# Altium schematic sheet P1.schdoc
size 508 x 381 mm; Symbol: Drawing-Symbol_A4; Company: 嘉立创EDA; Drawed: Adrian; Version: V1.0; @Project Name: F1C100S; @Update Date: 2025-12-29; @Create Date: 2025-12-29; Device: Drawing-Symbol_A4; @Board Name: Board1; @Page Name: P1; @Create Time: 16:48:25; @Page Count: 1; @Page No: 1; @Schematic Name: Schematic1; @Update Time: 16:48:25; @Assembly Variant: Basic; Border: 1; Title Block Position: 3; Size: A4; Width: 2000; Height: 1500; Region Start: 1; X Region Count: 6; Y Region Count: 4; Blade Width: 10; Title Block: 1
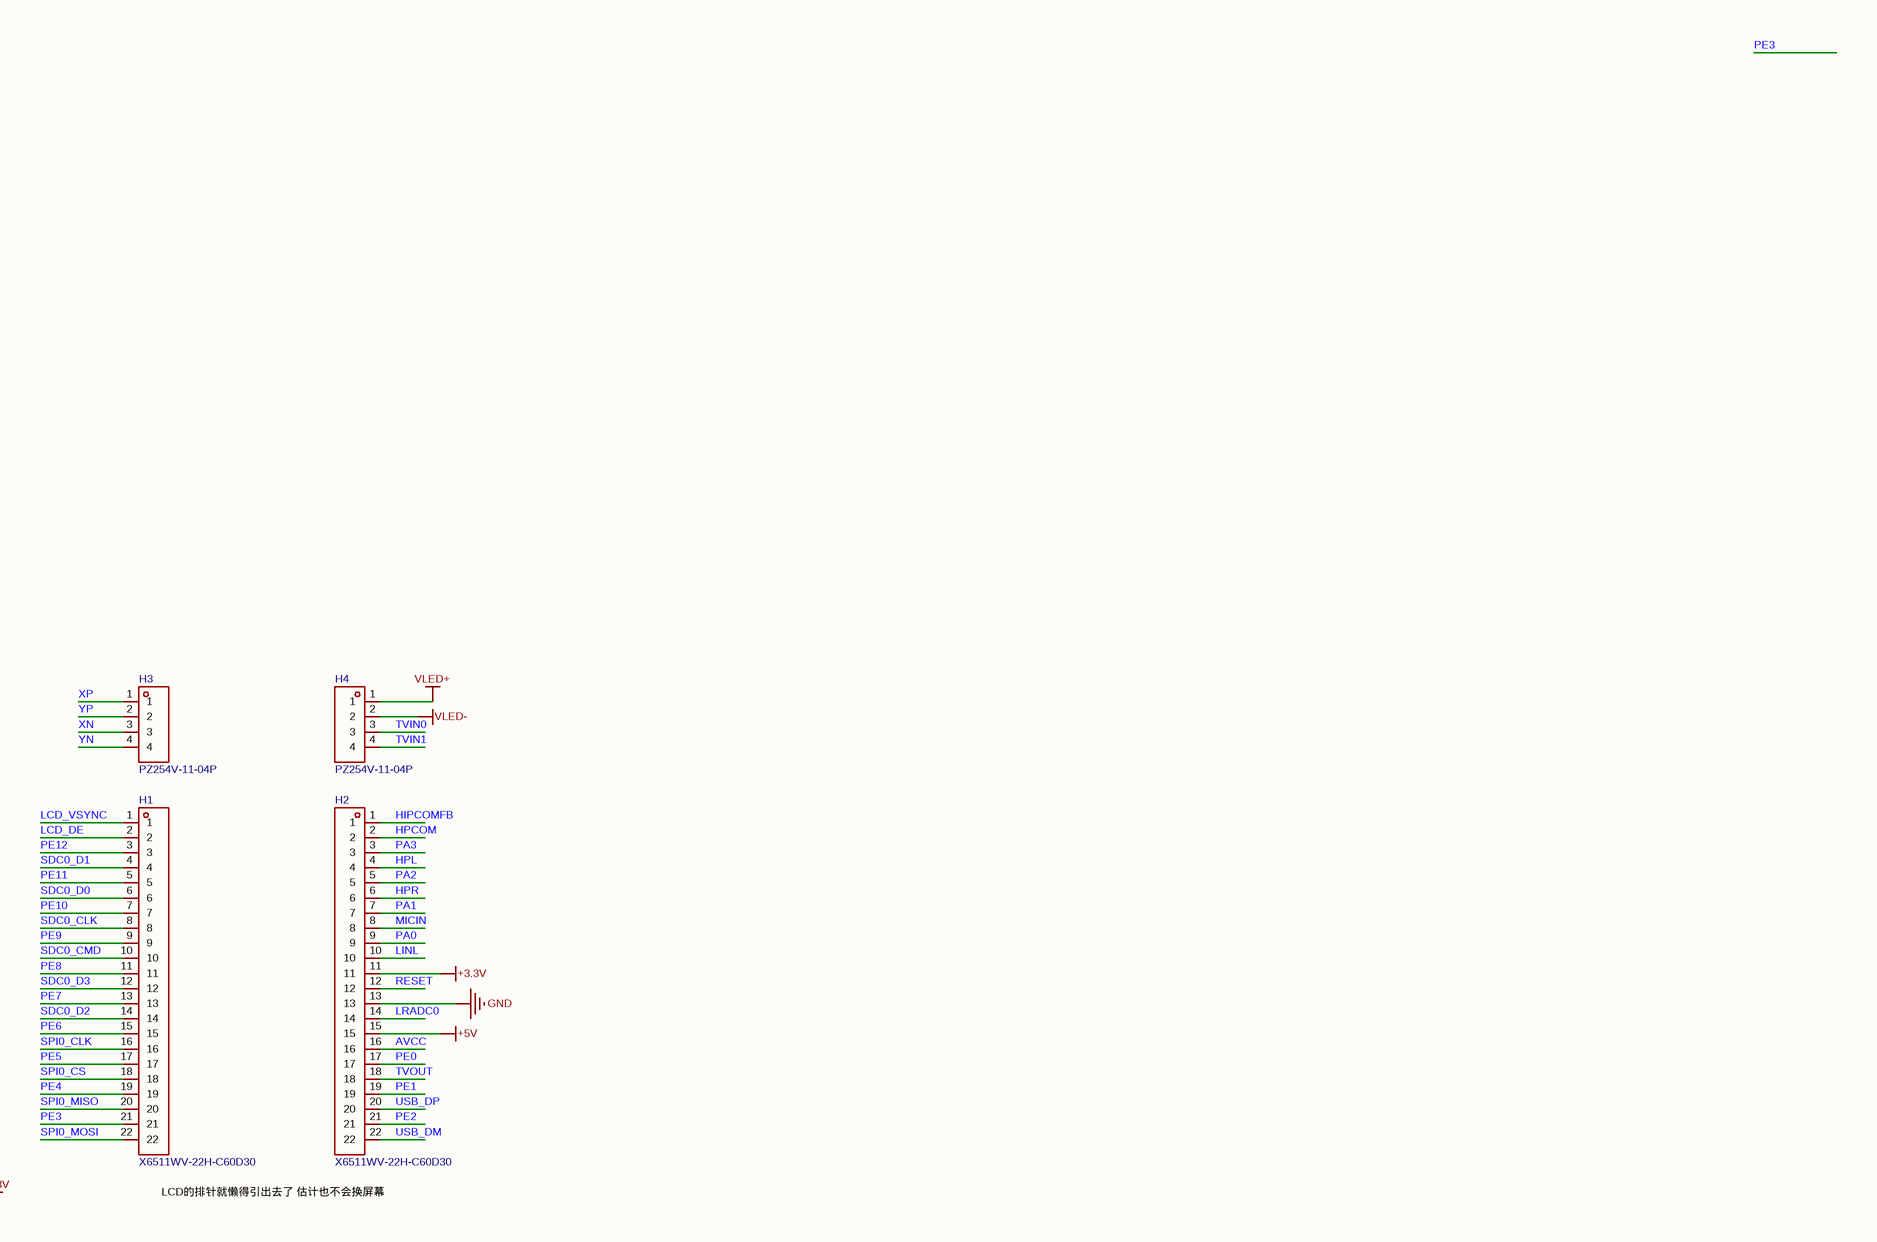
[diagram p0: P1.schdoc, top right]
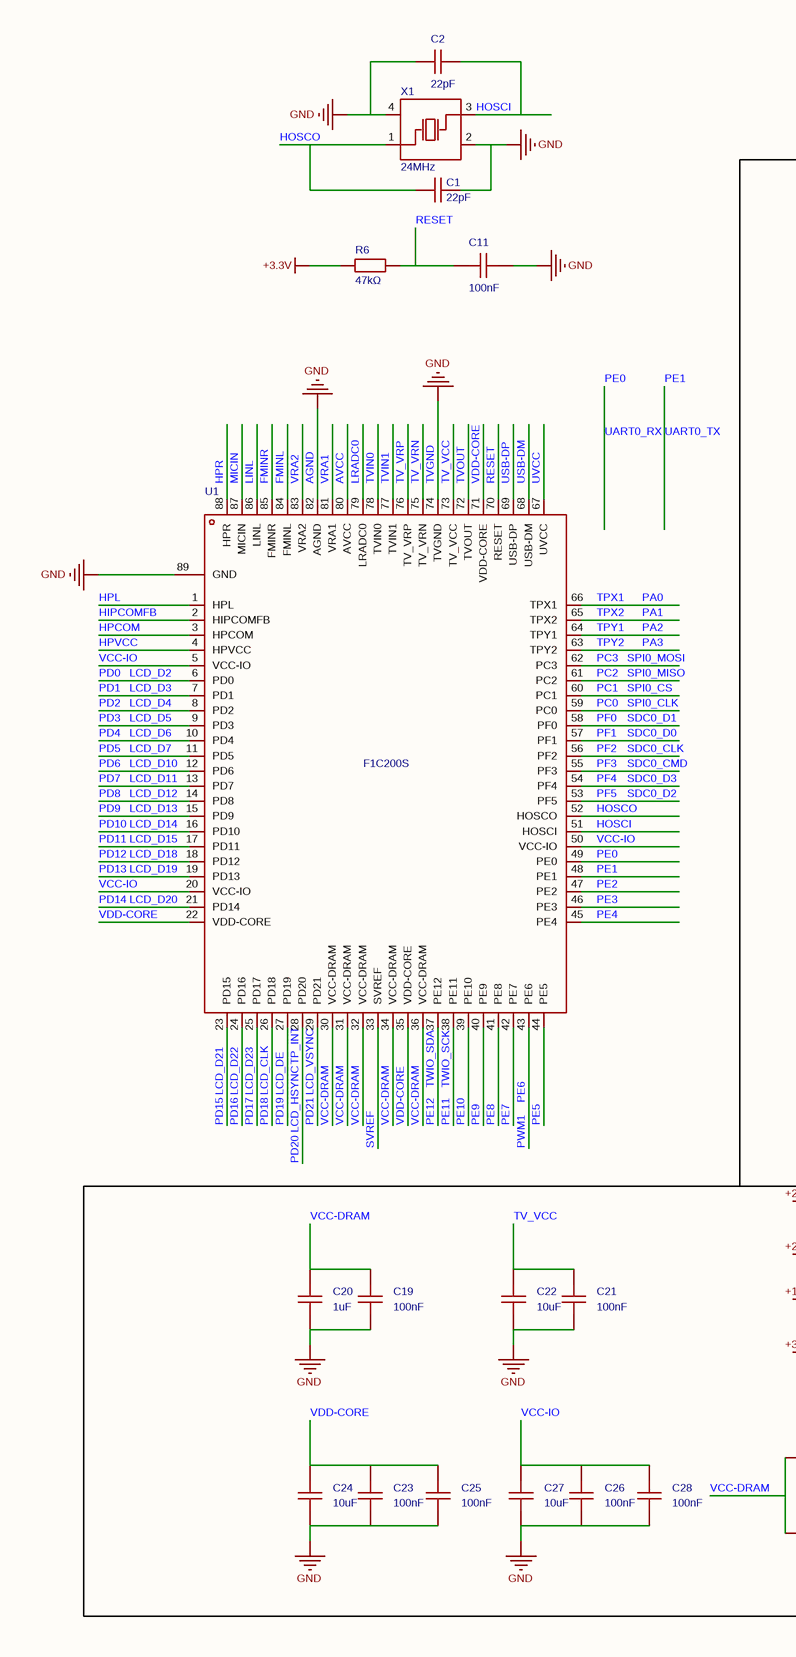
[diagram p1: P1.schdoc, bottom left]
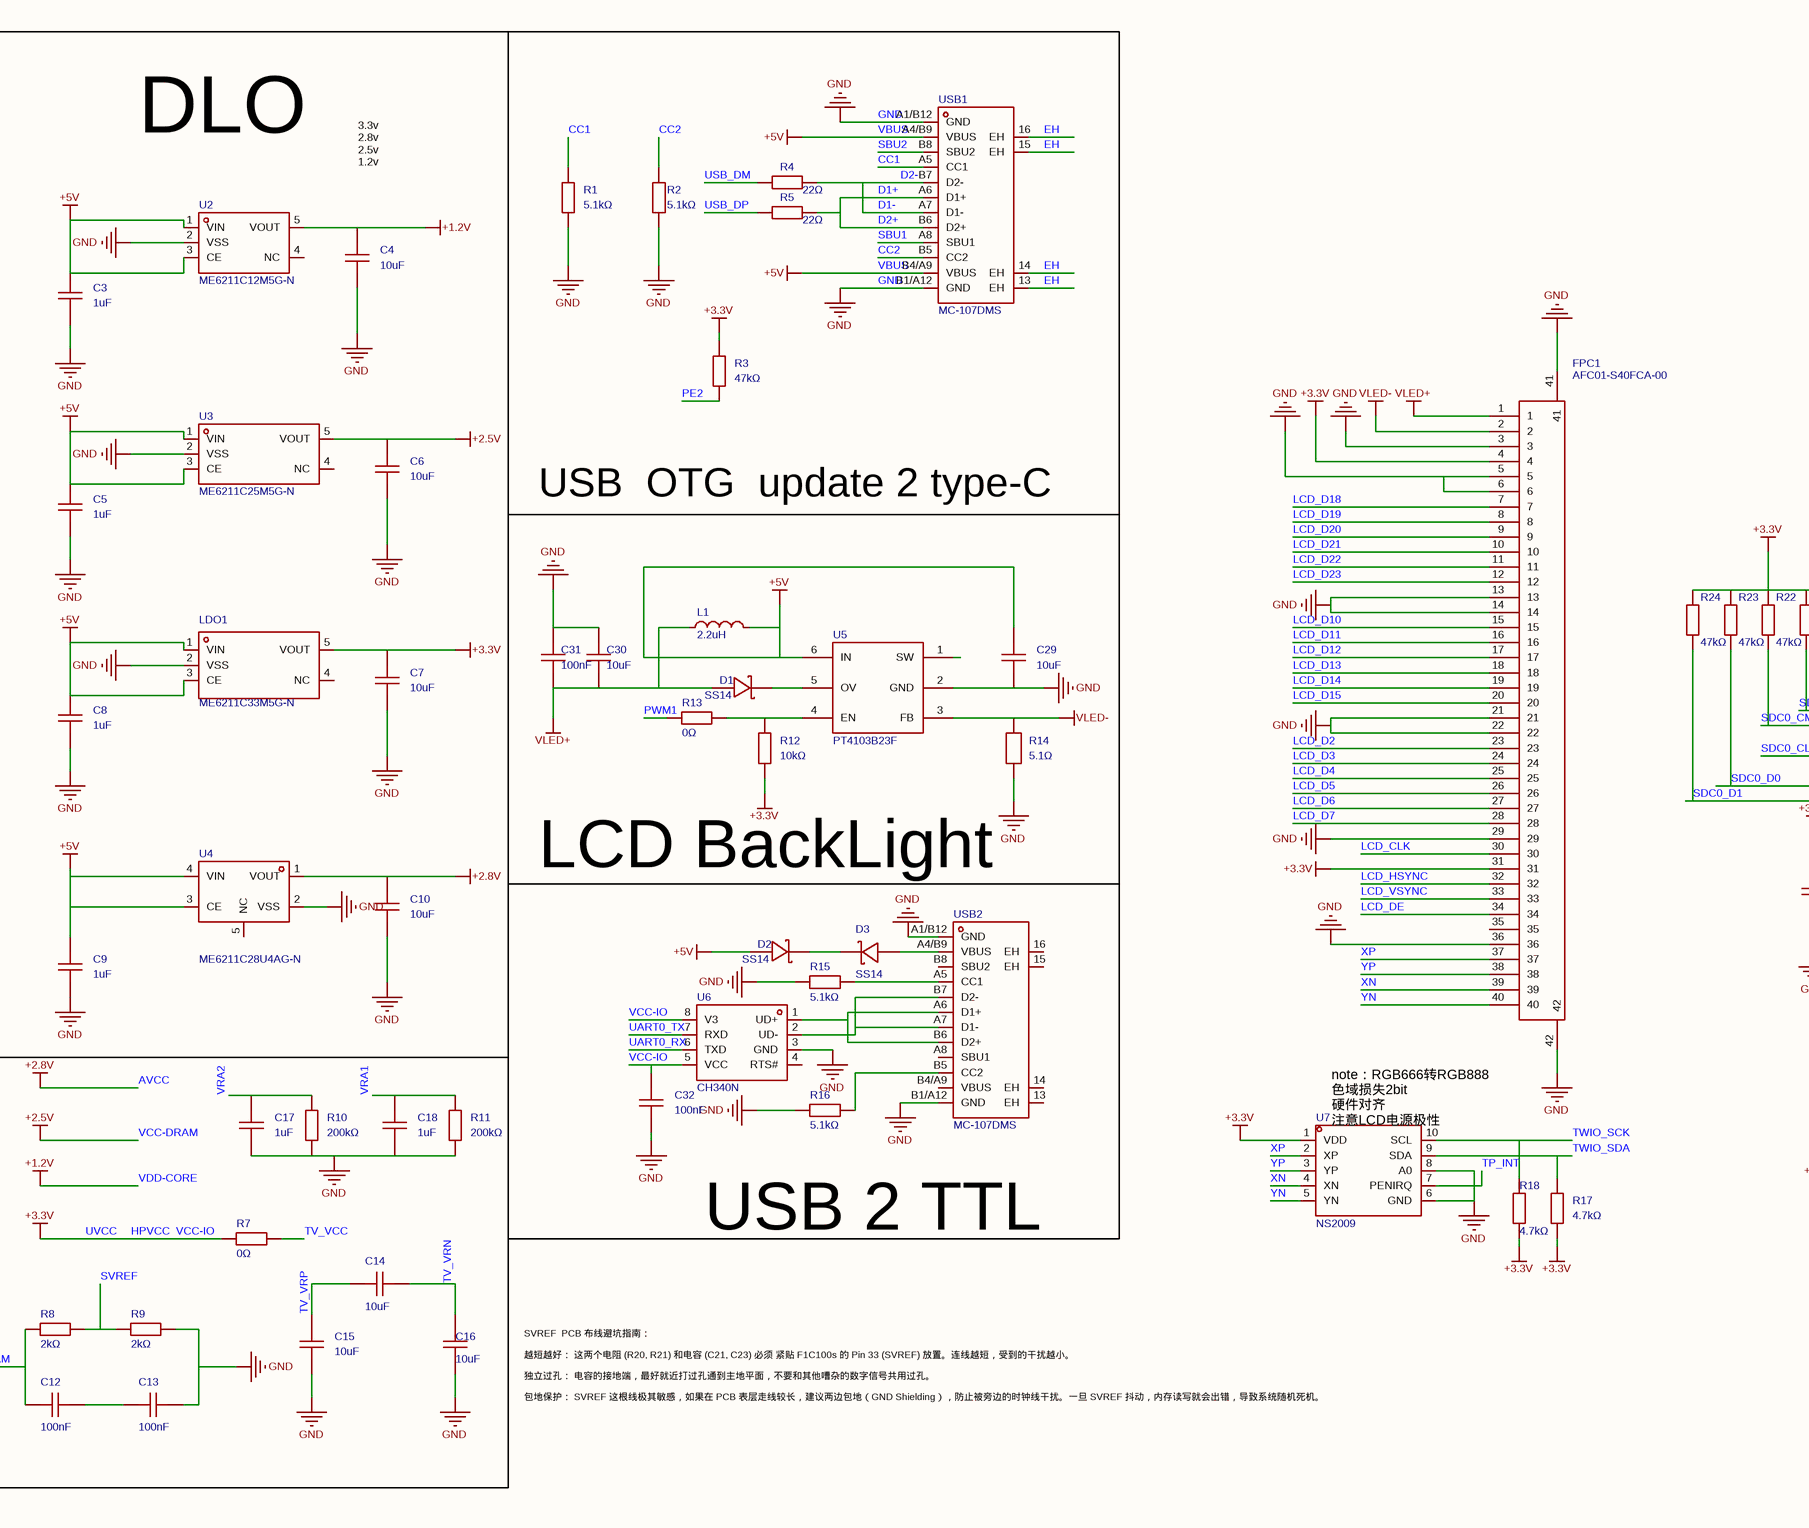
[diagram p2: P1.schdoc, bottom middle]
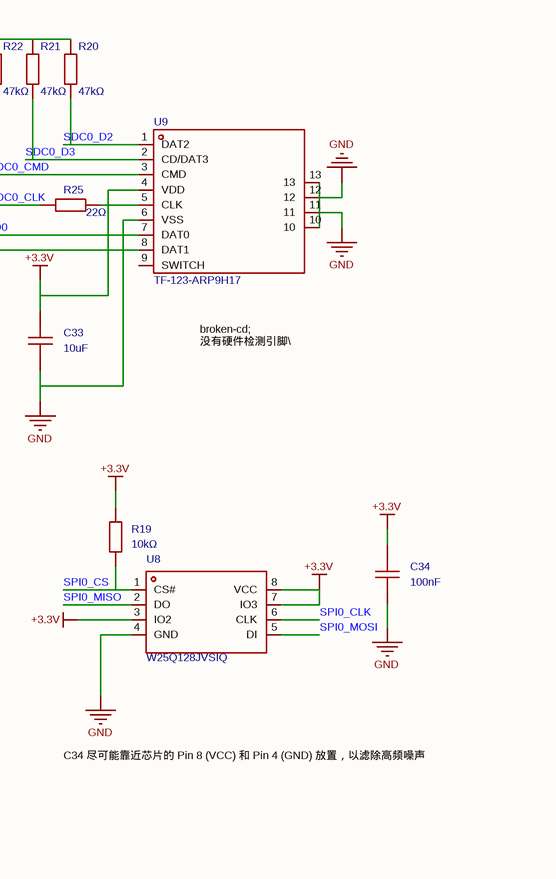
[diagram p3: P1.schdoc, bottom right]

## Parts
C1  22pF  [C0603]
C2  22pF  [C0603]
C3  1uF  [C0603]
C4  10uF  [C0603]
C5  1uF  [C0603]
C6  10uF  [C0603]
C7  10uF  [C0603]
C8  1uF  [C0603]
C9  1uF  [C0603]
C10  10uF  [C0603]
C11  100nF  [C0603]
C12  100nF  [C0603]
C13  100nF  [C0603]
C14  10uF  [C0603]
C15  10uF  [C0603]
C16  10uF  [C0603]
C17  1uF  [C0603]
C18  1uF  [C0603]
C19  100nF  [C0603]
C20  1uF  [C0603]
C21  100nF  [C0603]
C22  10uF  [C0603]
C23  100nF  [C0603]
C24  10uF  [C0603]
C25  100nF  [C0603]
C26  100nF  [C0603]
C27  10uF  [C0603]
C28  100nF  [C0603]
C29  10uF  [C0603]
C30  10uF  [C0603]
C31  100nF  [C0603]
C32  100nF  [C0603]
C33  10uF  [C0603]
C34  100nF  [C0603]
D1  SS14  [SMA_L4.3-W2.6-LS5.2-RD]
D2  SS14  [SMA_L4.3-W2.6-LS5.2-RD]
D3  SS14  [SMA_L4.3-W2.6-LS5.2-RD]
FPC1  AFC01-S40FCA-00  [FPC-SMD_AFC01-S40FCA-00]
H1  X6511WV-22H-C60D30  [HDR-TH_22P-P2.54-V-M]
H2  X6511WV-22H-C60D30  [HDR-TH_22P-P2.54-V-M]
H3  PZ254V-11-04P  [HDR-TH_4P-P2.54-V-M]
H4  PZ254V-11-04P  [HDR-TH_4P-P2.54-V-M]
L1  2.2uH  [IND-SMD_L2.5-W2.0_MHCHL2520]
LDO1  ME6211C33M5G-N  [SOT-23-5_L3.0-W1.7-P0.95-LS2.8-BL]
R1  5.1kΩ  [R0603]
R2  5.1kΩ  [R0603]
R3  47kΩ  [R0603]
R4  22Ω  [R0603]
R5  22Ω  [R0603]
R6  47kΩ  [R0603]
R7  0Ω  [R0603]
R8  2kΩ  [R0603]
R9  2kΩ  [R0603]
R10  200kΩ  [R0603]
R11  200kΩ  [R0603]
R12  10kΩ  [R0603]
R13  0Ω  [R0603]
R14  5.1Ω  [R0603]
R15  5.1kΩ  [R0603]
R16  5.1kΩ  [R0603]
R17  4.7kΩ  [R0603]
R18  4.7kΩ  [R0603]
R19  10kΩ  [R0603]
R20  47kΩ  [R0603]
R21  47kΩ  [R0603]
R22  47kΩ  [R0603]
R23  47kΩ  [R0603]
R24  47kΩ  [R0603]
R25  22Ω  [R0603]
U1  F1C200S  [QFN-88_L10.0-W10.0-P0.40-BL-EP6.75]
U2  ME6211C12M5G-N  [SOT-23-5_L3.0-W1.7-P0.95-LS2.8-BL]
U3  ME6211C25M5G-N  [SOT-23-5_L3.0-W1.7-P0.95-LS2.8-BR]
U4  ME6211C28U4AG-N  [FBP4L_L1.0-W1.0-P0.65-BL-EP]
U5  PT4103B23F  [SOT-23-6_L2.9-W1.6-P0.95-LS2.8-BR]
U6  CH340N  [SOP-8_L4.9-W3.9-P1.27-LS6.0-BL]
U7  NS2009  [MSOP-10_L3.0-W3.0-P0.50-LS5.0-BL]
U8  W25Q128JVSIQ  [SOIC-8_L5.3-W5.3-P1.27-LS8.0-BL]
U9  TF-123-ARP9H17  [TF-SMD_TF-123-ARP9H15]
USB1  MC-107DMS  [USB-C-SMD_MC-107DMS]
USB2  MC-107DMS  [USB-C-SMD_MC-107DMS]
X1  24MHz  [CRYSTAL-SMD_4P-L2.5-W2.0-BL]

## Blocks framed on the sheet
DLO: C3-C10 LDO1 U2-U4
USB  OTG  update 2 type-C: C29-C31 D1 L1 R12-R14 U5
LCD BackLight: C32 D2 D3 R15 R16 U6 USB2

## Nets
AGND: C1.2 C2.1 C3.1 C4.1 C5.1 C6.1 C7.1 C8.1 C9.1 C10.1 C11.2 C13.2 C15.1 C16.1 C17.1 C18.1 C19.1 C20.1 C21.1 C22.1 C23.1 C24.1 C25.1 C26.1 C27.1 C28.1 C29.1 C30.2 C31.2 C32.1 C33.2 C34.1 FPC1.3 FPC1.5 FPC1.6 FPC1.13 FPC1.14 FPC1.21 FPC1.22 FPC1.29 FPC1.36 FPC1.41 FPC1.42 H2.13 LDO1.2(VSS) R1.1 R2.1 R9.2 R10.1 R11.1 R14.1 R15.1 R16.1 U1.74(TVGND) U1.82(AGND) U1.89(GND) U2.2(VSS) U3.2(VSS) U4.2(VSS) U5.2(GND) U6.3(GND) U7.6(GND) U7.8(A0) U8.4(GND) U9.6(VSS) U9.10 U9.11 U9.12 U9.13 USB1.A1/B12(GND) USB1.B1/A12(GND) USB2.A1/B12(GND) USB2.B1/A12(GND) X1.2(GND) X1.4(GND)  [also labelled GND, TVGND]
AVCC: C10.2 H2.16 U1.80(AVCC) U4.1(VOUT)  [also labelled +2.8V]
HPVCC: C7.2 C26.2 C27.2 C28.2 C32.2 C33.1 C34.2 FPC1.4 FPC1.31 H2.11 LDO1.5(VOUT) R3.2 R6.1 R7.1 R12.1 R17.1 R18.1 R19.2 R20.2 R21.2 R22.2 R23.2 R24.2 U1.4(HPVCC) U1.5(VCC-IO) U1.20(VCC-IO) U1.50(VCC-IO) U1.67(UVCC) U6.5(VCC) U6.8(V3) U7.1(VDD) U8.3(IO2) U8.7(IO3) U8.8(VCC) U9.4(VDD)  [also labelled +3.3V, UVCC, VCC-IO]
VBUS: C3.2 C5.2 C8.2 C9.2 C29.2 D2.2(A) H2.15 L1.2 LDO1.1(VIN) LDO1.3(CE) U2.1(VIN) U2.3(CE) U3.1(VIN) U3.3(CE) U4.3(CE) U4.4(VIN) U5.6(IN) USB1.A4/B9(VBUS) USB1.B4/A9(VBUS)  [also labelled +5V]
VCC-DRAM: C6.2 C12.1 C19.2 C20.2 R8.1 U1.30(VCC-DRAM) U1.31(VCC-DRAM) U1.32(VCC-DRAM) U1.34(VCC-DRAM) U1.36(VCC-DRAM) U3.5(VOUT)  [also labelled +2.5V]
VDD-CORE: C4.2 C23.2 C24.2 C25.2 U1.22(VDD-CORE) U1.35(VDD-CORE) U1.71(VDD-CORE) U2.5(VOUT)  [also labelled +1.2V]
VLED+: C30.1 C31.1 D1.2(A) FPC1.1 H4.1 L1.1
VLED-: FPC1.2 H4.2 R14.2 U5.3(FB)
CC1: R1.2 USB1.A5(CC1)
CC2: R2.2 USB1.B5(CC2)
D1+: R5.2 USB1.A6(D1+) USB1.B6(D2+)  [also labelled D2+]
D1-: R4.2 USB1.A7(D1-) USB1.B7(D2-)  [also labelled D2-]
EH: USB1.13(EH) USB1.14(EH) USB1.15(EH) USB1.16(EH)
FMINL: U1.84(FMINL)
FMINR: U1.85(FMINR)
HIPCOMFB: H2.1 U1.2(HIPCOMFB)
HOSCI: C2.2 U1.51(HOSCI) X1.3(OSC2)
HOSCO: C1.1 U1.52(HOSCO) X1.1(OSC1)
HPCOM: H2.2 U1.3(HPCOM)
HPL: H2.4 U1.1(HPL)
HPR: H2.6 U1.88(HPR)
LCD_CLK: FPC1.30 U1.26(PD18)  [also labelled PD18]
LCD_D2: FPC1.23 U1.6(PD0)  [also labelled PD0]
LCD_D3: FPC1.24 U1.7(PD1)  [also labelled PD1]
LCD_D4: FPC1.25 U1.8(PD2)  [also labelled PD2]
LCD_D5: FPC1.26 U1.9(PD3)  [also labelled PD3]
LCD_D6: FPC1.27 U1.10(PD4)  [also labelled PD4]
LCD_D7: FPC1.28 U1.11(PD5)  [also labelled PD5]
LCD_D10: FPC1.15 U1.12(PD6)  [also labelled PD6]
LCD_D11: FPC1.16 U1.13(PD7)  [also labelled PD7]
LCD_D12: FPC1.17 U1.14(PD8)  [also labelled PD8]
LCD_D13: FPC1.18 U1.15(PD9)  [also labelled PD9]
LCD_D14: FPC1.19 U1.16(PD10)  [also labelled PD10]
LCD_D15: FPC1.20 U1.17(PD11)  [also labelled PD11]
LCD_D18: FPC1.7 U1.18(PD12)  [also labelled PD12]
LCD_D19: FPC1.8 U1.19(PD13)  [also labelled PD13]
LCD_D20: FPC1.9 U1.21(PD14)  [also labelled PD14]
LCD_D21: FPC1.10 U1.23(PD15)  [also labelled PD15]
LCD_D22: FPC1.11 U1.24(PD16)  [also labelled PD16]
LCD_D23: FPC1.12 U1.25(PD17)  [also labelled PD17]
LCD_DE: FPC1.34 H1.2 U1.27(PD19)  [also labelled PD19]
LCD_HSYNC: FPC1.32 U1.28(PD20) U7.7(PENIRQ)  [also labelled PD20, TP_INT]
LCD_VSYNC: FPC1.33 H1.1 U1.29(PD21)  [also labelled PD21]
LINL: H2.10 U1.86(LINL)
LRADC0: H2.14 U1.79(LRADC0)
MICIN: H2.8 U1.87(MICIN)
PA0: H2.9 U1.66(TPX1)  [also labelled TPX1]
PA1: H2.7 U1.65(TPX2)  [also labelled TPX2]
PA2: H2.5 U1.64(TPY1)  [also labelled TPY1]
PA3: H2.3 U1.63(TPY2)  [also labelled TPY2]
PC0: H1.16 U1.59(PC0) U8.6(CLK)  [also labelled SPI0_CLK]
PC1: H1.18 R19.1 U1.60(PC1) U8.1(CS#)  [also labelled SPI0_CS]
PC2: H1.20 U1.61(PC2) U8.2(DO)  [also labelled SPI0_MISO]
PC3: H1.22 U1.62(PC3) U8.5(DI)  [also labelled SPI0_MOSI]
PE0: H2.17 U1.49(PE0) U6.6(TXD)  [also labelled UART0_RX]
PE1: H2.19 U1.48(PE1) U6.7(RXD)  [also labelled UART0_TX]
PE2: H2.21 R3.1 U1.47(PE2)
PE3: H1.21 U1.46(PE3)
PE4: H1.19 U1.45(PE4)
PE5: H1.17 U1.44(PE5)
PE6: H1.15 R13.1 U1.43(PE6)  [also labelled PWM1]
PE7: H1.13 U1.42(PE7)
PE8: H1.11 U1.41(PE8)
PE9: H1.9 U1.40(PE9)
PE10: H1.7 U1.39(PE10)
PE11: H1.5 R18.2 U1.38(PE11) U7.10(SCL)  [also labelled TWIO_SCK]
PE12: H1.3 R17.2 U1.37(PE12) U7.9(SDA)  [also labelled TWIO_SDA]
PF0: H1.4 R24.1 U1.58(PF0) U9.8(DAT1)  [also labelled SDC0_D1]
PF1: H1.6 R23.1 U1.57(PF1) U9.7(DAT0)  [also labelled SDC0_D0]
PF2: H1.8 R25.1 U1.56(PF2)  [also labelled SDC0_CLK]
PF3: H1.10 R22.1 U1.55(PF3) U9.3(CMD)  [also labelled SDC0_CMD]
PF4: H1.12 R21.1 U1.54(PF4) U9.2(CD/DAT3)  [also labelled SDC0_D3]
PF5: H1.14 R20.1 U1.53(PF5) U9.1(DAT2)  [also labelled SDC0_D2]
RESET: C11.1 H2.12 R6.2 U1.70(RESET)
SBU1: USB1.A8(SBU1)
SBU2: USB1.B8(SBU2)
SVREF: R8.2 R9.1 U1.33(SVREF)
TV_VCC: C21.2 C22.2 R7.2 U1.73(TV_VCC)
TV_VRN: C14.2 C16.2 U1.75(TV_VRN)
TV_VRP: C14.1 C15.2 U1.76(TV_VRP)
TVIN0: H4.3 U1.78(TVIN0)
TVIN1: H4.4 U1.77(TVIN1)
TVOUT: H2.18 U1.72(TVOUT)
USB-DM: U1.68(USB-DM)
USB-DP: U1.69(USB-DP)
USB_DM: H2.22 R4.1
USB_DP: H2.20 R5.1
VRA1: C18.2 R11.2 U1.81(VRA1)
VRA2: C17.2 R10.2 U1.83(VRA2)
XN: FPC1.39 H3.3 U7.4(XN)
XP: FPC1.37 H3.1 U7.2(XP)
YN: FPC1.40 H3.4 U7.5(YN)
YP: FPC1.38 H3.2 U7.3(YP)
NetC12_2: C12.2 C13.1
NetD1_1: D1.1(K) U5.5(OV)
NetD2_1: D2.1(K) D3.1(K)
NetD3_2: D3.2(A) USB2.A4/B9(VBUS)
NetR12_2: R12.2 R13.2 U5.4(EN)
NetR15_2: R15.2 USB2.A5(CC1)
NetR16_2: R16.2 USB2.B5(CC2)
NetR25_2: R25.2 U9.5(CLK)
NetU6_1: U6.1(UD+) USB2.A6(D1+) USB2.B6(D2+)
NetU6_2: U6.2(UD-) USB2.A7(D1-) USB2.B7(D2-)

Not connected (* = marked no-connect by the designer): FPC1 35; LDO1 4(NC); U2 4(NC); U3 4(NC); U4 5(NC); U5 1(SW); U6 4(RTS#); U9 9(SWITCH); USB2 13(EH) 14(EH) 15(EH) 16(EH) A8(SBU1) B4/A9(VBUS) B8(SBU2)

## Notes on the sheet
- (near C4) 3.3v
  2.8v
  2.5v
  1.2v
- (near H1) LCD的排针就懒得引出去了 估计也不会换屏幕
- broken-cd;
  没有硬件检测引脚\
- (near U7) note：RGB666转RGB888
  色域损失2bit
  硬件对齐
  注意LCD电源极性
- USB 2 TTL
- SVREF  PCB 布线避坑指南：
  越短越好： 这两个电阻 (R20, R21) 和电容 (C21, C23) 必须 紧贴 F1C100s 的 Pin 33 (SVREF) 放置。连线越短，受到的干扰越小。
  独立过孔： 电容的接地端，最好就近打过孔通到主地平面，不要和其他嘈杂的数字信号共用过孔。
  包地保护： SVREF 这根线极其敏感，如果在 PCB 表层走线较长，建议两边包地（GND Shielding），防止被旁边的时钟线干扰。一旦 SVREF 抖动，内存读写就会出错，导致系统随机死机。
- C34 尽可能靠近芯片的 Pin 8 (VCC) 和 Pin 4 (GND) 放置，以滤除高频噪声
- 1
- 2
- 3
- 4
- 5
- 6
- A
- B
- C
- D
- 创建日期
- 2025-12-29
- 原理图
- 板子
- Schematic1
- Board1
- 更新日期
- 图页
- P1
- 绘制
- 审阅
- Adrian
- F1C100S
- 版本
- V1.0
- 尺寸
- 页    1    共    1
- 嘉立创EDA

## Library data of the parts
C1 C2 = CL10C220JB8NNNC: 容值:22pF;精度:±5%;额定电压:50V;温度系数:C0G;; Manufacturer: SAMSUNG(三星); AddInBom: yes; ModelId: ac125912035d415993ca9572d50418b10819f05c4eef4c71ace90d822a990e87; ModelName: C0603_L1.6-W0.8-H0.8; ModelTransform: 62.992,31.496,0,0,0,0,0,0,0; Tolerance: ±5%; Voltage Rating: 50V; Temperature Coefficient: C0G; Symbol: CL10C220JB8NNNC; Device: CL10C220JB8NNNC; LCSC Part Name: 22pF ±5% 50V; SupplierPart: C1653; ManufacturerPart: CL10C220JB8NNNC; Supplier Footprint: 0603; JLCPCB Part Class: Basic Part; Datasheet: https://item.szlcsc.com/datasheet/CL10C220JB8NNNC/2005.html; Supplier: LCSC; ConvertToPcb: yes; FootprintName: C0603; Value: 22pF
C3 C5 C8 = CGA0603X5R105K500JT: 容值:1uF;精度:±10%;额定电压:50V;温度系数:X5R;; Manufacturer: HRE(芯声); AddInBom: yes; ModelId: ac125912035d415993ca9572d50418b10819f05c4eef4c71ace90d822a990e87; ModelName: C0603_L1.6-W0.8-H0.8; ModelTransform: 62.992,31.496,0,0,0,0,0,0,0; Tolerance: ±10%; Voltage Rating: 50V; Temperature Coefficient: X5R; Symbol: CGA0603X5R105K500JT; Device: CGA0603X5R105K500JT; LCSC Part Name: 1uF ±10% 50V; SupplierPart: C6119852; ManufacturerPart: CGA0603X5R105K500JT; Supplier Footprint: 0603; JLCPCB Part Class: Extended Part; Datasheet: https://item.szlcsc.com/datasheet/CGA0603X5R105K500JT/7062558.html; Supplier: LCSC; ConvertToPcb: yes; FootprintName: C0603; Value: 1uF
C4 C6 C7 = CGA0603X5R106K100JT: 容值:10uF;精度:±10%;额定电压:10V;温度系数:X5R;; Manufacturer: HRE(芯声); AddInBom: yes; ModelId: ac125912035d415993ca9572d50418b10819f05c4eef4c71ace90d822a990e87; ModelName: C0603_L1.6-W0.8-H0.8; ModelTransform: 62.992,31.496,0,0,0,0,0,0,0; Tolerance: ±10%; Voltage Rating: 10V; Temperature Coefficient: X5R; Symbol: CGA0603X5R106K100JT; Device: CGA0603X5R106K100JT; LCSC Part Name: 10uF ±10% 10V; SupplierPart: C6119842; ManufacturerPart: CGA0603X5R106K100JT; Supplier Footprint: 0603; JLCPCB Part Class: Extended Part; Datasheet: https://item.szlcsc.com/datasheet/CGA0603X5R106K100JT/7062548.html; Supplier: LCSC; ConvertToPcb: yes; FootprintName: C0603; Value: 10uF
C9 = CGA0603X5R105K500JT: 容值:1uF;精度:±10%;额定电压:50V;温度系数:X5R;; Manufacturer: HRE(芯声); 3D Model: ac125912035d415993ca9572d50418b10819f05c4eef4c71ace90d822a990e87; 3D Model Transform: 62.992,31.496,0,0,0,0,0,0,0; Tolerance: ±10%; Voltage Rating: 50V; Temperature Coefficient: X5R; AddInBom: yes; ModelName: C0603_L1.6-W0.8-H0.8; Symbol: CGA0603X5R105K500JT; Device: CGA0603X5R105K500JT; LCSC Part Name: 1uF ±10% 50V; Supplier Part: C6119852; Manufacturer Part: CGA0603X5R105K500JT; Supplier Footprint: 0603; JLCPCB Part Class: Extended Part; Datasheet: https://item.szlcsc.com/datasheet/CGA0603X5R105K500JT/7062558.html; Supplier: LCSC; Value: 1uF; ConvertToPcb: yes; FootprintName: C0603
C10 C33 = CGA0603X5R106K100JT: 容值:10uF;精度:±10%;额定电压:10V;温度系数:X5R;; Manufacturer: HRE(芯声); 3D Model: ac125912035d415993ca9572d50418b10819f05c4eef4c71ace90d822a990e87; 3D Model Transform: 62.992,31.496,0,0,0,0,0,0,0; Tolerance: ±10%; Voltage Rating: 10V; Temperature Coefficient: X5R; AddInBom: yes; ModelName: C0603_L1.6-W0.8-H0.8; Symbol: CGA0603X5R106K100JT; Device: CGA0603X5R106K100JT; LCSC Part Name: 10uF ±10% 10V; Supplier Part: C6119842; Manufacturer Part: CGA0603X5R106K100JT; Supplier Footprint: 0603; JLCPCB Part Class: Extended Part; Datasheet: https://item.szlcsc.com/datasheet/CGA0603X5R106K100JT/7062548.html; Supplier: LCSC; Value: 10uF; ConvertToPcb: yes; FootprintName: C0603
C11-C13 C19 C21 C23 C25 C26 C28 = CC0603KRX7R9BB104: 容值:100nF;精度:±10%;额定电压:50V;温度系数:X7R;; Manufacturer: YAGEO(国巨); AddInBom: yes; ModelId: ac125912035d415993ca9572d50418b10819f05c4eef4c71ace90d822a990e87; ModelName: C0603_L1.6-W0.8-H0.8; ModelTransform: 62.992,31.496,0,0,0,0,0,0,0; Tolerance: ±10%; Voltage Rating: 50V; Temperature Coefficient: X7R; Symbol: CC0603KRX7R9BB104; Device: CC0603KRX7R9BB104; LCSC Part Name: 100nF ±10% 50V; SupplierPart: C14663; ManufacturerPart: CC0603KRX7R9BB104; Supplier Footprint: 0603; JLCPCB Part Class: Basic Part; Datasheet: https://item.szlcsc.com/datasheet/CC0603KRX7R9BB104/15331.html; Supplier: LCSC; ConvertToPcb: yes; FootprintName: C0603; Value: 100nF
C14-C16 C22 C24 C27 C29 = CL10A106KP8NNNC: 容值:10uF;精度:±10%;额定电压:10V;温度系数:X5R;; Manufacturer: SAMSUNG(三星); AddInBom: yes; ModelId: ac125912035d415993ca9572d50418b10819f05c4eef4c71ace90d822a990e87; ModelName: C0603_L1.6-W0.8-H0.8; ModelTransform: 62.992,31.496,0,0,0,0,0,0,0; Tolerance: ±10%; Voltage Rating: 10V; Temperature Coefficient: X5R; Symbol: CL10A106KP8NNNC; Device: CL10A106KP8NNNC; LCSC Part Name: 10uF ±10% 10V; SupplierPart: C19702; ManufacturerPart: CL10A106KP8NNNC; Supplier Footprint: 0603; JLCPCB Part Class: Basic Part; Datasheet: https://item.szlcsc.com/datasheet/CL10A106KP8NNNC/20411.html; Supplier: LCSC; ConvertToPcb: yes; FootprintName: C0603; Value: 10uF
C17 C18 C20 = CL10A105KB8NNNC: 容值:1uF;精度:±10%;额定电压:50V;温度系数:X5R;; Manufacturer: SAMSUNG(三星); AddInBom: yes; ModelId: ac125912035d415993ca9572d50418b10819f05c4eef4c71ace90d822a990e87; ModelName: C0603_L1.6-W0.8-H0.8; ModelTransform: 62.992,31.496,0,0,0,0,0,0,0; Tolerance: ±10%; Voltage Rating: 50V; Temperature Coefficient: X5R; Symbol: CL10A105KB8NNNC; Device: CL10A105KB8NNNC; LCSC Part Name: 1uF ±10% 50V; SupplierPart: C15849; ManufacturerPart: CL10A105KB8NNNC; Supplier Footprint: 0603; JLCPCB Part Class: Basic Part; Datasheet: https://item.szlcsc.com/datasheet/CL10A105KB8NNNC/16531.html; Supplier: LCSC; ConvertToPcb: yes; FootprintName: C0603; Value: 1uF
C30 = HGC0603R5106M350NTHJ: 容值:10uF;精度:±20%;额定电压:35V;温度系数:X5R;; Manufacturer: Chinocera(华瓷); AddInBom: yes; ModelId: ac125912035d415993ca9572d50418b10819f05c4eef4c71ace90d822a990e87; ModelName: C0603_L1.6-W0.8-H0.8; ModelTransform: 62.992,31.496,0,0,0,0,0,0,0; Tolerance: ±20%; Voltage Rating: 35V; Temperature Coefficient: X5R; Symbol: HGC0603R5106M350NTHJ; Device: HGC0603R5106M350NTHJ; LCSC Part Name: 10uF ±20% 35V; SupplierPart: C22367827; ManufacturerPart: HGC0603R5106M350NTHJ; Supplier Footprint: 0603; JLCPCB Part Class: Extended Part; Datasheet: https://item.szlcsc.com/datasheet/HGC0603R5106M350NTHJ/23841132.html; Supplier: LCSC; ConvertToPcb: yes; FootprintName: C0603; Value: 10uF
C31 = CGA0603X7R104K500JT: 容值:100nF;精度:±10%;额定电压:50V;温度系数:X7R;; Manufacturer: HRE(芯声); AddInBom: yes; ModelId: ac125912035d415993ca9572d50418b10819f05c4eef4c71ace90d822a990e87; ModelName: C0603_L1.6-W0.8-H0.8; ModelTransform: 62.992,31.496,0,0,0,0,0,0,0; Tolerance: ±10%; Voltage Rating: 50V; Temperature Coefficient: X7R; Symbol: CGA0603X7R104K500JT; Device: CGA0603X7R104K500JT; LCSC Part Name: 100nF ±10% 50V; SupplierPart: C6119867; ManufacturerPart: CGA0603X7R104K500JT; Supplier Footprint: 0603; JLCPCB Part Class: Extended Part; Datasheet: https://item.szlcsc.com/datasheet/CGA0603X7R104K500JT/7062573.html; Supplier: LCSC; ConvertToPcb: yes; FootprintName: C0603; Value: 100nF
C32 C34 = CC0603KRX7R9BB104: 容值:100nF;精度:±10%;额定电压:50V;温度系数:X7R;; Manufacturer: YAGEO(国巨); 3D Model: ac125912035d415993ca9572d50418b10819f05c4eef4c71ace90d822a990e87; 3D Model Transform: 62.992,31.496,0,0,0,0,0,0,0; Tolerance: ±10%; Voltage Rating: 50V; Temperature Coefficient: X7R; AddInBom: yes; ModelName: C0603_L1.6-W0.8-H0.8; Symbol: CC0603KRX7R9BB104; Device: CC0603KRX7R9BB104; LCSC Part Name: 100nF ±10% 50V; Supplier Part: C14663; Manufacturer Part: CC0603KRX7R9BB104; Supplier Footprint: 0603; JLCPCB Part Class: Basic Part; Datasheet: https://item.szlcsc.com/datasheet/CC0603KRX7R9BB104/15331.html; Supplier: LCSC; Value: 100nF; ConvertToPcb: yes; FootprintName: C0603
D1 = SS14_C83852: 正向压降(Vf):500mV@1A;直流反向耐压(Vr):40V;整流电流:1A;; Manufacturer: onsemi(安森美); AddInBom: yes; ModelId: e3551acb3c5a4975a5e9d36087fe1fa20819f05c4eef4c71ace90d822a990e87; ModelTransform: 185.039,102.362,0,0,0,0,0,0,0; Voltage - DC Reverse(Vr): 40V; Current - Rectified: 1A; Reverse Leakage Current (Ir): 200uA@40V; Operating Junction Temperature Range: -65℃~+125℃; Non-Repetitive Peak Forward Surge Current: 40A; Symbol: SS14_C83852; Device: SS14_C83852; LCSC Part Name: 电压:40V 电流:1A; SupplierPart: C83852; ManufacturerPart: SS14; Supplier Footprint: SMA(DO-214AC); JLCPCB Part Class: Extended Part; Datasheet: https://item.szlcsc.com/datasheet/SS14/85019.html; Supplier: LCSC; ConvertToPcb: yes; FootprintName: SMA_L4.3-W2.6-LS5.2-RD; ModelName: SMA_L4.3-W2.6-LS5.2-RD; Voltage - Forward(Vf@If): 500mV@1A
D2 D3 = SS14_C83852: 正向压降(Vf):500mV@1A;直流反向耐压(Vr):40V;整流电流:1A;; Manufacturer: onsemi(安森美); 3D Model: e3551acb3c5a4975a5e9d36087fe1fa20819f05c4eef4c71ace90d822a990e87; 3D Model Transform: 185.039,102.362,0,0,0,0,0,0,0; Voltage - DC Reverse(Vr): 40V; Current - Rectified: 1A; Reverse Leakage Current (Ir): 200uA@40V; Operating Junction Temperature Range: -65℃~+125℃; Non-Repetitive Peak Forward Surge Current: 40A; AddInBom: yes; Symbol: SS14_C83852; Device: SS14_C83852; LCSC Part Name: 电压:40V 电流:1A; Supplier Part: C83852; Manufacturer Part: SS14; Supplier Footprint: SMA(DO-214AC); JLCPCB Part Class: Extended Part; Datasheet: https://item.szlcsc.com/datasheet/SS14/85019.html; Supplier: LCSC; Voltage - Forward(Vf@If): 500mV@1A; ConvertToPcb: yes; FootprintName: SMA_L4.3-W2.6-LS5.2-RD; ModelName: SMA_L4.3-W2.6-LS5.2-RD
FPC1 = AFC01-S40FCA-00: 锁定特性:翻盖式;触点类型:下接;触点数量:40P;间距:0.5mm;安装方式:卧贴;工作温度:-45℃~+85℃;; Manufacturer: JS(钜硕电子); AddInBom: yes; ModelId: 458e5f3c71f743329f5584acd337d3c80819f05c4eef4c71ace90d822a990e87; ModelTransform: 961.0217,240.157,0,0,0,0,0,-52.441,0; Locking Feature: 翻盖式; Number of Contacts: 40P; Pitch: 0.5mm; FFC, FCB Thickness: 0.3mm; Rated Voltage (Max): 50V; Current Rating (Max): 500mA; Symbol: AFC01-S40FCA-00; Device: AFC01-S40FCA-00; LCSC Part Name: 翻盖式 下接 P数:40P 间距:0.5mm; SupplierPart: C262674; ManufacturerPart: AFC01-S40FCA-00; Supplier Footprint: SMD,P=0.5mm,卧贴; JLCPCB Part Class: Extended Part; Datasheet: https://item.szlcsc.com/datasheet/AFC01-S40FCA-00/253933.html; Supplier: LCSC; ConvertToPcb: yes; FootprintName: FPC-SMD_AFC01-S40FCA-00; ModelName: FPC-SMD_AFC01-S40FCA-00; Contact Type: 下接; Mounting Type: 卧贴; Height Above Board: 2mm; Contact Material: 铜合金; Contact Plating: 锡; Operating Temperature: -45℃~+85℃
H1 H2 = X6511WV-22H-C60D30: 插针结构:1x22P;间距:2.54mm;行距:2.54mm;圆针/方针:方针;排数:单排;总PIN位数:22P;额定电流:3A;额定电压:250V;配合针长度:-;塑高:2.5mm;端接针长度:-;触头材质:黄铜;触头镀层:金;工作温度:-40℃~+105℃;颜色:黑色;; Manufacturer: XKB Connection(中国星坤); Symbol: X6511WV-22H-C30D60; AddInBom: yes; ModelId: 875f4c094945453e8148e92095c9b8a70819f05c4eef4c71ace90d822a990e87; ModelName: HDR-TH_22P-P2.54-M-LI-1X22P; ModelTransform: 2199.99552,98.425,0,0,0,0,0,0,-118.11; Pin Structure: 1x22P; Pitch: 2.54mm; Circluar Pins/Square Pins: 方针; Current Rating: 3A; Voltage Rating (Max): 250V; Device: X6511WV-22H-C60D30; LCSC Part Name: 1x22P 间距:2.54mm 方针; SupplierPart: C725954; ManufacturerPart: X6511WV-22H-C60D30; Supplier Footprint: 插件,P=2.54mm; JLCPCB Part Class: Extended Part; Datasheet: https://item.szlcsc.com/datasheet/X6511WV-22H-C60D30/772403.html; Supplier: LCSC; ConvertToPcb: yes; FootprintName: HDR-TH_22P-P2.54-V-M; Row Spacing: 2.54mm; Number of Rows: 单排; Number of Pins: 22P; Length of Mating Pin: -; Insulation Height: 2.5mm; Length of End Connection Pin: -; Contact Material: 黄铜; Contact Plating: 金; Operating Temperature: -40℃~+105℃; Color: 黑色
H3 H4 = PZ254V-11-04P: 插针结构:1x4P;间距:2.54mm;行距:-;圆针/方针:方针;安装方式:直插;排数:单排;总PIN位数:4P;额定电流:3A;额定电压:250V;配合针长度:6mm;塑高:2.5mm;端接针长度:3mm;触头材质:-;工作温度:-40℃~+105℃;颜色:黑色;; Manufacturer: XFCN(兴飞); Symbol: PZ254V-11-04P_C2691448; AddInBom: yes; ModelId: 112f4d05e8d64e99ab9a333894bea4f90819f05c4eef4c71ace90d822a990e87; ModelName: HDR-TH_4P-P2.54-M-LI-1X4P; ModelTransform: 399.999,104.7242,0,0,0,0,0,0,-118.11; Pin Structure: 1x4P; Pitch: 2.54mm; Circluar Pins/Square Pins: 方针; Current Rating: 3A; Voltage Rating (Max): 250V; Device: PZ254V-11-04P; LCSC Part Name: 1x4P 间距:2.54mm 方针 直插; SupplierPart: C2691448; ManufacturerPart: PZ254V-11-04P; Supplier Footprint: 插件,P=2.54mm; JLCPCB Part Class: Extended Part; Datasheet: https://item.szlcsc.com/datasheet/PZ254V-11-04P/2801085.html; Supplier: LCSC; ConvertToPcb: yes; FootprintName: HDR-TH_4P-P2.54-V-M; Row Spacing: -; Mounting Type: 直插; Number of Rows: 单排; Number of Pins: 4P; Length of Mating Pin: 6mm; Insulation Height: 2.5mm; Length of End Connection Pin: 3mm; Contact Material: -; Operating Temperature: -40℃~+105℃; Color: 黑色
L1 = FTC252012S2R2MBCA: 电感值:2.2uH;精度:±20%;额定电流:3A;饱和电流(Isat):3.8A;类型:一体成型电感;; Manufacturer: cjiang(长江微电); AddInBom: yes; ModelId: 37a0cdb2b8b148059a23edc55a737e420819f05c4eef4c71ace90d822a990e87; ModelTransform: 98.425,78.74,0,0,0,0,0,0,0; Tolerance: ±20%; Rated Current: 3A; Saturation Current (Isat): 3.8A; DC Resistance (DCR): 55mΩ; Type: 一体成型电感; Symbol: FTC252012S2R2MBCA; Device: FTC252012S2R2MBCA; LCSC Part Name: 2.2uH ±20% 3.8A; SupplierPart: C5832372; ManufacturerPart: FTC252012S2R2MBCA; Supplier Footprint: 1008; JLCPCB Part Class: Extended Part; Datasheet: https://atta.szlcsc.com/upload/public/pdf/source/20230602/8FFEDA9C0247A92A0D4B67554BFE4091.pdf; Supplier: LCSC; ConvertToPcb: yes; FootprintName: IND-SMD_L2.5-W2.0_MHCHL2520; ModelName: IND-SMD_L2.5-W2.0_MHCHL2520; Value: 2.2uH
LDO1 = ME6211C33M5G-N: 输出类型:固定;工作电压:6V;输出电压:3.3V;输出电流:500mA;电源纹波抑制比(PSRR):70dB@(1kHz);输出极性:正极;; Manufacturer: MICRONE(南京微盟); AddInBom: yes; ModelId: 0a2a1b8f50944f73965918ad6e5fe1670819f05c4eef4c71ace90d822a990e87; ModelName: SOT-23-5_L2.9-W1.6-H1.1-LS2.8-P0.95; ModelTransform: 118.60433,114.173,0,90,0,0,0.0005,0.0005,0; Output Type: 固定; Voltage - Supply: 6V; Output Voltage: 3.3V; Output Current: 500mA; Voltage Dropout: 120mV@(100mA); standby current: 60uA; Noise: 50uVrms; Output Configuration: 正极; Number of Outputs: 1; Symbol: ME6211C33M5G-N; Device: ME6211C33M5G-N; LCSC Part Name: 输入6V 输出3.3V 500mA; SupplierPart: C82942; ManufacturerPart: ME6211C33M5G-N; Supplier Footprint: SOT-23-5; JLCPCB Part Class: Extended Part; Datasheet: https://item.szlcsc.com/datasheet/ME6211C33M5G-N/84106.html; Supplier: LCSC; ConvertToPcb: yes; FootprintName: SOT-23-5_L3.0-W1.7-P0.95-LS2.8-BL; Power Supply Rejection Ratio (PSRR): 70dB@(1kHz); Features: 过流保护；带使能；短路保护; Operating Temperature: -40℃~+150℃
R1 R2 = 0603WAF5101T5E: 电阻类型:厚膜电阻;阻值:5.1kΩ;精度:±1%;功率:100mW;工作电压:75V;温度系数:±100ppm/℃;; Manufacturer: UNI-ROYAL(厚声); AddInBom: yes; ModelId: fc143cca1e79419f9cd78b61e9279f080819f05c4eef4c71ace90d822a990e87; ModelTransform: 31.8897,63.7794,0,90,0,0,0,0,0; Tolerance: ±1%; Power(Watts): 100mW; Voltage-Supply(Max): 75V; Symbol: 0603WAF5101T5E; Device: 0603WAF5101T5E; LCSC Part Name: 5.1kΩ ±1% 100mW 厚膜电阻; SupplierPart: C23186; ManufacturerPart: 0603WAF5101T5E; Supplier Footprint: 0603; JLCPCB Part Class: Basic Part; Datasheet: https://item.szlcsc.com/datasheet/0603WAF5101T5E/23913.html; Supplier: LCSC; ConvertToPcb: yes; FootprintName: R0603; ModelName: R0603; Type: 厚膜电阻; Value: 5.1kΩ; Temperature Coefficient: ±100ppm/℃; Operating Temperature: -55℃~+155℃
R3 = 0603WAF4702T5E: 电阻类型:厚膜电阻;阻值:47kΩ;精度:±1%;功率:100mW;工作电压:75V;温度系数:±100ppm/℃;; Manufacturer: UNI-ROYAL(厚声); AddInBom: yes; ModelId: fc143cca1e79419f9cd78b61e9279f080819f05c4eef4c71ace90d822a990e87; ModelTransform: 31.8897,63.7794,0,90,0,0,0,0,0; Tolerance: ±1%; Power(Watts): 100mW; Voltage-Supply(Max): 75V; Symbol: 0603WAF4702T5E; Device: 0603WAF4702T5E; LCSC Part Name: 47kΩ ±1% 100mW 厚膜电阻; SupplierPart: C25819; ManufacturerPart: 0603WAF4702T5E; Supplier Footprint: 0603; JLCPCB Part Class: Basic Part; Datasheet: https://item.szlcsc.com/datasheet/0603WAF4702T5E/26562.html; Supplier: LCSC; ConvertToPcb: yes; FootprintName: R0603; ModelName: R0603; Type: 厚膜电阻; Value: 47kΩ; Temperature Coefficient: ±100ppm/℃; Operating Temperature: -55℃~+155℃
R4 R5 = 0603WAF220JT5E: 电阻类型:厚膜电阻;阻值:22Ω;精度:±1%;功率:100mW;最大工作电压:75V;温度系数:±100ppm/℃;; Manufacturer: UNI-ROYAL(厚声); AddInBom: yes; ModelId: fc143cca1e79419f9cd78b61e9279f080819f05c4eef4c71ace90d822a990e87; ModelTransform: 31.8897,63.7794,0,90,0,0,0,0,0; Tolerance: ±1%; Power(Watts): 100mW; Overload Voltage (Max): 75V; Symbol: 0603WAF220JT5E; Device: 0603WAF220JT5E; LCSC Part Name: 22Ω ±1% 100mW 厚膜电阻; SupplierPart: C23345; ManufacturerPart: 0603WAF220JT5E; Supplier Footprint: 0603; JLCPCB Part Class: Basic Part; Datasheet: https://atta.szlcsc.com/upload/public/pdf/source/20200306/C422600_1E6D84923E4A46A82E41ADD87F860B5C.pdf; Supplier: LCSC; ConvertToPcb: yes; FootprintName: R0603; ModelName: R0603; Type: 厚膜电阻; Value: 22Ω; Temperature Coefficient: ±100ppm/℃; Operating Temperature Range: -55℃~+155℃
R6 R20-R24 = 0603WAF4702T5E: 电阻类型:厚膜电阻;阻值:47kΩ;精度:±1%;功率:100mW;工作电压:75V;温度系数:±100ppm/℃;; Manufacturer: UNI-ROYAL(厚声); 3D Model: fc143cca1e79419f9cd78b61e9279f080819f05c4eef4c71ace90d822a990e87; 3D Model Transform: 31.8897,63.7794,0,90,0,0,0,0,0; Tolerance: ±1%; Power(Watts): 100mW; Voltage-Supply(Max): 75V; AddInBom: yes; Symbol: 0603WAF4702T5E; Device: 0603WAF4702T5E; LCSC Part Name: 47kΩ ±1% 100mW 厚膜电阻; Supplier Part: C25819; Manufacturer Part: 0603WAF4702T5E; Supplier Footprint: 0603; JLCPCB Part Class: Basic Part; Datasheet: https://item.szlcsc.com/datasheet/0603WAF4702T5E/26562.html; Supplier: LCSC; Type: 厚膜电阻; Value: 47kΩ; Temperature Coefficient: ±100ppm/℃; Operating Temperature: -55℃~+155℃; ConvertToPcb: yes; FootprintName: R0603; ModelName: R0603
R7 R13 = 0603WAF0000T5E: 电阻类型:厚膜电阻;阻值:0Ω;精度:±1%;功率:100mW;工作电压:75V;温度系数:-;; Manufacturer: UNI-ROYAL(厚声); AddInBom: yes; ModelId: fc143cca1e79419f9cd78b61e9279f080819f05c4eef4c71ace90d822a990e87; ModelTransform: 31.8897,63.7794,0,90,0,0,0,0,0; Tolerance: ±1%; Power(Watts): 100mW; Voltage-Supply(Max): 75V; Symbol: 0603WAF0000T5E; Device: 0603WAF0000T5E; LCSC Part Name: 0Ω ±1% 100mW 厚膜电阻; SupplierPart: C21189; ManufacturerPart: 0603WAF0000T5E; Supplier Footprint: 0603; JLCPCB Part Class: Basic Part; Datasheet: https://item.szlcsc.com/datasheet/0603WAF0000T5E/21903.html; Supplier: LCSC; ConvertToPcb: yes; FootprintName: R0603; ModelName: R0603; Type: 厚膜电阻; Value: 0Ω; Temperature Coefficient: -; Operating Temperature: -55℃~+155℃
R8 R9 = 0603WAF2001T5E: 电阻类型:厚膜电阻;阻值:2kΩ;精度:±1%;功率:100mW;工作电压:75V;温度系数:±100ppm/℃;; Manufacturer: UNI-ROYAL(厚声); AddInBom: yes; ModelId: fc143cca1e79419f9cd78b61e9279f080819f05c4eef4c71ace90d822a990e87; ModelTransform: 31.8897,63.7794,0,90,0,0,0,0,0; Tolerance: ±1%; Power(Watts): 100mW; Voltage-Supply(Max): 75V; Symbol: 0603WAF2001T5E; Device: 0603WAF2001T5E; LCSC Part Name: 2kΩ ±1% 100mW 厚膜电阻; SupplierPart: C22975; ManufacturerPart: 0603WAF2001T5E; Supplier Footprint: 0603; JLCPCB Part Class: Basic Part; Datasheet: https://item.szlcsc.com/datasheet/0603WAF2001T5E/23702.html; Supplier: LCSC; ConvertToPcb: yes; FootprintName: R0603; ModelName: R0603; Type: 厚膜电阻; Value: 2kΩ; Temperature Coefficient: ±100ppm/℃; Operating Temperature: -55℃~+155℃
R10 R11 = 0603WAF2003T5E: 电阻类型:厚膜电阻;阻值:200kΩ;精度:±1%;功率:100mW;最大工作电压:75V;温度系数:±100ppm/℃;; Manufacturer: UNI-ROYAL(厚声); AddInBom: yes; ModelId: fc143cca1e79419f9cd78b61e9279f080819f05c4eef4c71ace90d822a990e87; ModelTransform: 31.8897,63.7794,0,90,0,0,0,0,0; Tolerance: ±1%; Power(Watts): 100mW; Overload Voltage (Max): 75V; Symbol: 0603WAF2003T5E; Device: 0603WAF2003T5E; LCSC Part Name: 200kΩ ±1% 100mW 厚膜电阻; SupplierPart: C25811; ManufacturerPart: 0603WAF2003T5E; Supplier Footprint: 0603; JLCPCB Part Class: Basic Part; Datasheet: https://atta.szlcsc.com/upload/public/pdf/source/20200306/C422600_1E6D84923E4A46A82E41ADD87F860B5C.pdf; Supplier: LCSC; ConvertToPcb: yes; FootprintName: R0603; ModelName: R0603; Type: 厚膜电阻; Value: 200kΩ; Temperature Coefficient: ±100ppm/℃; Operating Temperature Range: -55℃~+155℃
R12 = 0603WAF1002T5E: 电阻类型:厚膜电阻;阻值:10kΩ;精度:±1%;功率:100mW;工作电压:75V;温度系数:±100ppm/℃;; Manufacturer: UNI-ROYAL(厚声); AddInBom: yes; ModelId: fc143cca1e79419f9cd78b61e9279f080819f05c4eef4c71ace90d822a990e87; ModelTransform: 31.8897,63.7794,0,90,0,0,0,0,0; Tolerance: ±1%; Power(Watts): 100mW; Voltage-Supply(Max): 75V; Symbol: 0603WAF1002T5E; Device: 0603WAF1002T5E; LCSC Part Name: 厚膜电阻 10kΩ ±1% 100mW; SupplierPart: C25804; ManufacturerPart: 0603WAF1002T5E; Supplier Footprint: 0603; JLCPCB Part Class: Basic Part; Datasheet: https://item.szlcsc.com/datasheet/0603WAF1002T5E/26547.html; Supplier: LCSC; ConvertToPcb: yes; FootprintName: R0603; ModelName: R0603; Type: 厚膜电阻; Value: 10kΩ; Temperature Coefficient: ±100ppm/℃; Operating Temperature: -55℃~+155℃
R14 = FRC0603F5R10TS: 电阻类型:厚膜电阻;阻值:5.1Ω;精度:±1%;功率:100mW;工作电压:75V;温度系数:±200ppm/℃;; Manufacturer: FOJAN(富捷); AddInBom: yes; ModelId: fc143cca1e79419f9cd78b61e9279f080819f05c4eef4c71ace90d822a990e87; ModelTransform: 31.8897,63.7794,0,90,0,0,0,0,0; Tolerance: ±1%; Power(Watts): 100mW; Voltage-Supply(Max): 75V; Symbol: FRC0603F5R10TS; Device: FRC0603F5R10TS; LCSC Part Name: 5.1Ω ±1% 100mW 厚膜电阻; SupplierPart: C2907045; ManufacturerPart: FRC0603F5R10TS; Supplier Footprint: 0603; JLCPCB Part Class: Extended Part; Supplier: LCSC; ConvertToPcb: yes; FootprintName: R0603; ModelName: R0603; Type: 厚膜电阻; Value: 5.1Ω; Temperature Coefficient: ±200ppm/℃; Operating Temperature: -55℃~+155℃
R15 R16 = 0603WAF5101T5E: 电阻类型:厚膜电阻;阻值:5.1kΩ;精度:±1%;功率:100mW;工作电压:75V;温度系数:±100ppm/℃;; Manufacturer: UNI-ROYAL(厚声); 3D Model: fc143cca1e79419f9cd78b61e9279f080819f05c4eef4c71ace90d822a990e87; 3D Model Transform: 31.8897,63.7794,0,90,0,0,0,0,0; Tolerance: ±1%; Power(Watts): 100mW; Voltage-Supply(Max): 75V; AddInBom: yes; Symbol: 0603WAF5101T5E; Device: 0603WAF5101T5E; LCSC Part Name: 5.1kΩ ±1% 100mW 厚膜电阻; Supplier Part: C23186; Manufacturer Part: 0603WAF5101T5E; Supplier Footprint: 0603; JLCPCB Part Class: Basic Part; Datasheet: https://item.szlcsc.com/datasheet/0603WAF5101T5E/23913.html; Supplier: LCSC; Type: 厚膜电阻; Value: 5.1kΩ; Temperature Coefficient: ±100ppm/℃; Operating Temperature: -55℃~+155℃; ConvertToPcb: yes; FootprintName: R0603; ModelName: R0603
R17 R18 = 0603WAF4701T5E: 电阻类型:厚膜电阻;阻值:4.7kΩ;精度:±1%;功率:100mW;工作电压:75V;温度系数:±100ppm/℃;; Manufacturer: UNI-ROYAL(厚声); AddInBom: yes; ModelId: fc143cca1e79419f9cd78b61e9279f080819f05c4eef4c71ace90d822a990e87; ModelTransform: 31.8897,63.7794,0,90,0,0,0,0,0; Tolerance: ±1%; Power(Watts): 100mW; Voltage-Supply(Max): 75V; Symbol: 0603WAF4701T5E; Device: 0603WAF4701T5E; LCSC Part Name: 4.7kΩ ±1% 100mW 厚膜电阻; SupplierPart: C23162; ManufacturerPart: 0603WAF4701T5E; Supplier Footprint: 0603; JLCPCB Part Class: Basic Part; Datasheet: https://item.szlcsc.com/datasheet/0603WAF4701T5E/23889.html; Supplier: LCSC; ConvertToPcb: yes; FootprintName: R0603; ModelName: R0603; Type: 厚膜电阻; Value: 4.7kΩ; Temperature Coefficient: ±100ppm/℃; Operating Temperature: -55℃~+155℃
R19 = 0603WAF1002T5E: 电阻类型:厚膜电阻;阻值:10kΩ;精度:±1%;功率:100mW;工作电压:75V;温度系数:±100ppm/℃;; Manufacturer: UNI-ROYAL(厚声); 3D Model: fc143cca1e79419f9cd78b61e9279f080819f05c4eef4c71ace90d822a990e87; 3D Model Transform: 31.8897,63.7794,0,90,0,0,0,0,0; Tolerance: ±1%; Power(Watts): 100mW; Voltage-Supply(Max): 75V; AddInBom: yes; Symbol: 0603WAF1002T5E; Device: 0603WAF1002T5E; LCSC Part Name: 厚膜电阻 10kΩ ±1% 100mW; Supplier Part: C25804; Manufacturer Part: 0603WAF1002T5E; Supplier Footprint: 0603; JLCPCB Part Class: Basic Part; Datasheet: https://item.szlcsc.com/datasheet/0603WAF1002T5E/26547.html; Supplier: LCSC; Type: 厚膜电阻; Value: 10kΩ; Temperature Coefficient: ±100ppm/℃; Operating Temperature: -55℃~+155℃; ConvertToPcb: yes; FootprintName: R0603; ModelName: R0603
R25 = 0603WAF220JT5E: 电阻类型:厚膜电阻;阻值:22Ω;精度:±1%;功率:100mW;最大工作电压:75V;温度系数:±100ppm/℃;; Manufacturer: UNI-ROYAL(厚声); 3D Model: fc143cca1e79419f9cd78b61e9279f080819f05c4eef4c71ace90d822a990e87; 3D Model Transform: 31.8897,63.7794,0,90,0,0,0,0,0; Tolerance: ±1%; Power(Watts): 100mW; Overload Voltage (Max): 75V; AddInBom: yes; Symbol: 0603WAF220JT5E; Device: 0603WAF220JT5E; LCSC Part Name: 22Ω ±1% 100mW 厚膜电阻; Supplier Part: C23345; Manufacturer Part: 0603WAF220JT5E; Supplier Footprint: 0603; JLCPCB Part Class: Basic Part; Datasheet: https://atta.szlcsc.com/upload/public/pdf/source/20200306/C422600_1E6D84923E4A46A82E41ADD87F860B5C.pdf; Supplier: LCSC; Type: 厚膜电阻; Value: 22Ω; Temperature Coefficient: ±100ppm/℃; Operating Temperature Range: -55℃~+155℃; ConvertToPcb: yes; FootprintName: R0603; ModelName: R0603
U1 = F1C200S: CPU内核:-;; Manufacturer: Allwinner(全志); AddInBom: yes; ModelId: 9fbb6eebc76e44f2957bc86852556e570819f05c4eef4c71ace90d822a990e87; ModelName: QFN-88_L10.0-W10.0-H0.8-P0.40-BL-EP; ModelTransform: 393.7,393.7,0,0,0,0,0,0,0; Symbol: F1C200S; Device: F1C200S; LCSC Part Name: Allwinner F1C200S; SupplierPart: C2879851; ManufacturerPart: F1C200S; Supplier Footprint: QFN-88-EP(10x10); JLCPCB Part Class: Extended Part; Datasheet: https://item.szlcsc.com/datasheet/F1C200S/3089073.html; Supplier: LCSC; ConvertToPcb: yes; FootprintName: QFN-88_L10.0-W10.0-P0.40-BL-EP6.75; CPU Core: -
U2 = ME6211C12M5G-N: 输出类型:固定;工作电压:6V;输出电压:1.2V;输出电流:300mA;电源纹波抑制比(PSRR):70dB@(1kHz);输出极性:正极;; Manufacturer: MICRONE(南京微盟); AddInBom: yes; ModelId: 0a2a1b8f50944f73965918ad6e5fe1670819f05c4eef4c71ace90d822a990e87; ModelName: SOT-23-5_L2.9-W1.6-H1.1-LS2.8-P0.95; ModelTransform: 118.60433,114.173,0,90,0,0,0.0005,0.0005,0; Output Type: 固定; Voltage - Supply: 6V; Output Voltage: 1.2V; Output Current: 300mA; Voltage Dropout: 280mV@(100mA)；500mV@(200mA); standby current: 30uA; Noise: 50uVrms; Output Configuration: 正极; Number of Outputs: 1; Symbol: ME6211C12M5G-N; Device: ME6211C12M5G-N; LCSC Part Name: 输入6.5V 输出1.2V 300mA; SupplierPart: C236672; ManufacturerPart: ME6211C12M5G-N; Supplier Footprint: SOT-23-5; JLCPCB Part Class: Extended Part; Datasheet: https://item.szlcsc.com/datasheet/ME6211C12M5G-N/236112.html; Supplier: LCSC; ConvertToPcb: yes; FootprintName: SOT-23-5_L3.0-W1.7-P0.95-LS2.8-BL; Power Supply Rejection Ratio (PSRR): 70dB@(1kHz); Features: 带使能；过流保护; Operating Temperature: -40℃~+150℃
U3 = ME6211C25M5G-N: 输出类型:固定;工作电压:6V;输出电压:2.5V;输出电流:400mA;电源纹波抑制比(PSRR):62dB@(10kHz);输出极性:正极;; Manufacturer: MICRONE(南京微盟); AddInBom: yes; ModelId: 0a2a1b8f50944f73965918ad6e5fe1670819f05c4eef4c71ace90d822a990e87; ModelName: SOT-23-5_L2.9-W1.6-H1.1-LS2.8-P0.95; ModelTransform: 114.173,109.636,0,180,0,0,0,0,0; Output Type: 固定; Voltage - Supply: 6V; Output Voltage: 2.5V; Output Current: 400mA; Voltage Dropout: 110mV@(100mA)；220mV@(200mA); standby current: 30uA; Noise: 50uVrms; Output Configuration: 正极; Number of Outputs: 1; Symbol: ME6211C25M5G-N; Device: ME6211C25M5G-N; LCSC Part Name: 输入6.5V 输出2.5V 300mA; SupplierPart: C194395; ManufacturerPart: ME6211C25M5G-N; Supplier Footprint: SOT-23-5; JLCPCB Part Class: Extended Part; Datasheet: https://item.szlcsc.com/datasheet/ME6211C25M5G-N/235633.html; Supplier: LCSC; ConvertToPcb: yes; FootprintName: SOT-23-5_L3.0-W1.7-P0.95-LS2.8-BR; Power Supply Rejection Ratio (PSRR): 62dB@(10kHz); Features: 带使能；短路保护; Operating Temperature: -40℃~+150℃
U4 = ME6211C28U4AG-N: 输出类型:固定;工作电压:6V;输出电压:2.8V;输出电流:450mA;电源纹波抑制比(PSRR):62dB@(10kHz);输出极性:正极;; Manufacturer: MICRONE(南京微盟); AddInBom: yes; ModelId: 3d6cac0e125249e2adf07943bc4f40a50819f05c4eef4c71ace90d822a990e87; ModelTransform: 43.307,43.307,0,0,0,0,0,0,0; Output Type: 固定; Voltage - Supply: 6V; Output Voltage: 2.8V; Output Current: 450mA; Voltage Dropout: 220mV@(200mA); standby current: 30uA; Noise: 50uVrms; Output Configuration: 正极; Number of Outputs: 1; Symbol: ME6211C28U4AG-N; Device: ME6211C28U4AG-N; LCSC Part Name: 输入6.5V 输出2.8V 300mA; SupplierPart: C427594; ManufacturerPart: ME6211C28U4AG-N; Supplier Footprint: X2-SON-4-EP(1x1); JLCPCB Part Class: Extended Part; Datasheet: https://item.szlcsc.com/datasheet/ME6211C28U4AG-N/421834.html; Supplier: LCSC; ConvertToPcb: yes; FootprintName: FBP4L_L1.0-W1.0-P0.65-BL-EP; ModelName: FBP4L_L1.0-W1.0-P0.65-BL-EP; Power Supply Rejection Ratio (PSRR): 62dB@(10kHz); Features: 带使能；过流保护；过热保护; Operating Temperature: -40℃~+150℃
U5 = PT4103B23F: 类型:DC-DC;工作电压(DC):2.5V~6V;开关频率:1MHz~1.5MHz;通道数:1;调光:PWM；模拟;拓扑结构:升压;; Manufacturer: PowTech(华润矽威); AddInBom: yes; ModelId: 18da8f6c14a34920b3e136b5c401a1190819f05c4eef4c71ace90d822a990e87; ModelName: SOT-23-6_L2.9-W1.6-H1.5-LS2.8-P0.95; ModelTransform: 110.73671,114.173,0,180,0,0,0.001,-0.003,0; Number of Channels: 1; Dimming: PWM；模拟; Topology: 升压; Symbol: PT4103B23F; Device: PT4103B23F; LCSC Part Name: PT4103B23F 停产; SupplierPart: C19861; ManufacturerPart: PT4103B23F; Supplier Footprint: SOT-23-6; JLCPCB Part Class: Extended Part; Datasheet: https://item.szlcsc.com/datasheet/PT4103B23F/20570.html; Supplier: LCSC; ConvertToPcb: yes; FootprintName: SOT-23-6_L2.9-W1.6-P0.95-LS2.8-BR; Type: DC-DC; Voltage - Input(DC): 2.5V~6V; Frequency - Switching: 1MHz~1.5MHz; Features: 过压保护(OVP); Operating temperature: -40℃~+85℃
U6 = CH340N: 应用功能:USB转串口;USB协议版本:USB 2.0;通道数:1;数据速率:2Mbps;; Manufacturer: WCH(南京沁恒); Symbol: CH340N_C2977777; AddInBom: yes; ModelId: 75c24a7891ee4dd6bdac16a7163ff87e0819f05c4eef4c71ace90d822a990e87; ModelName: SOP-8_L4.9-W3.9-P1.27-LS6.0-BL-1; ModelTransform: 192.913,236.22,0,0,0,0,0,0,0; Applications Function: USB转串口; USB Protocol: USB 2.0; Number of Channels: 1; Voltage - Supply: 3.3V；5V; Data Rate: 2Mbps; Device: CH340N; LCSC Part Name: USB2.0芯片CH340; SupplierPart: C2977777; ManufacturerPart: CH340N; Supplier Footprint: SOP-8; JLCPCB Part Class: Extended Part; Datasheet: https://item.szlcsc.com/datasheet/CH340N/3390257.html; Supplier: LCSC; ConvertToPcb: yes; FootprintName: SOP-8_L4.9-W3.9-P1.27-LS6.0-BL; Operating Temperature: -20℃~+70℃
U7 = NS2009: 分辨率:12位;接口类型:I2C;工作电压:2V~5.5V;; Manufacturer: Nsiway(纳芯威); AddInBom: yes; ModelId: b42a31f9e1fa4643bc7ea573b9bba7ed0819f05c4eef4c71ace90d822a990e87; ModelName: MSOP-10_L3.0-W3.0-H1.1-LS5.0-P0.50; ModelTransform: 118.11,196.85,0,0,0,0,0,0,0; Resolution (Bits): 12位; Interface: I2C; Gain Error: ±4LSB; Symbol: NS2009; Device: NS2009; LCSC Part Name: NS2009; SupplierPart: C219024; ManufacturerPart: NS2009; Supplier Footprint: MSOP-10; JLCPCB Part Class: Extended Part; Datasheet: https://item.szlcsc.com/datasheet/NS2009/219781.html; Supplier: LCSC; ConvertToPcb: yes; FootprintName: MSOP-10_L3.0-W3.0-P0.50-LS5.0-BL; Touch Screen Type: -; Voltage - Supply: 2V~5.5V; Operating Temperature: -40℃~+85℃
U8 = W25Q128JVSIQ: 接口类型:SPI;存储容量:128Mbit;时钟频率(fc):133MHz;; Manufacturer: Winbond(华邦); Symbol: W25Q128JVSIQTR; AddInBom: yes; ModelId: f83d990ad74f400caf5ac920b77715080819f05c4eef4c71ace90d822a990e87; ModelName: SOIC-8_L5.3-W5.3-H1.9-LS7.9-P1.27; ModelTransform: 208.661,311.25654,0,0,0,0,-0.0005,0.0005,0; Interface: SPI; Clock Frequency: 133MHz; Voltage - Supply: 2.7V~3.6V; Standby Supply Current: 1uA; Program / Erase Cycles: 100000次; Page Programming Time (Tpp): 3ms; Block Erase Time(tBE): 120ms@(32KB); Data Retention - TDR (Year): 20年; Device: W25Q128JVSIQ; LCSC Part Name: 编带 支持双路/四路SPI接口的3V、128Mbit 串行闪存; SupplierPart: C97521; ManufacturerPart: W25Q128JVSIQ; Supplier Footprint: SOIC-8-208mil; JLCPCB Part Class: Basic Part; Datasheet: https://item.szlcsc.com/datasheet/W25Q128JVSIQ/98729.html; Supplier: LCSC; ConvertToPcb: yes; FootprintName: SOIC-8_L5.3-W5.3-P1.27-LS8.0-BL; Memory Size: 128Mbit; Operating Temperature: -40℃~+85℃
U9 = TF-123-ARP9H17: 卡连接方式:拔插式;卡类型:MicroSD卡(TF卡);连接器类型:卡座;本体最大高度:1.7mm;工作温度:-25℃~+85℃;; Manufacturer: XUNPU(讯普); AddInBom: yes; ModelId: 007dbba047754cac9da90cd1932acd700819f05c4eef4c71ace90d822a990e87; ModelTransform: 442.9125,275.59,0,0,0,0,-0.003,7.871,0; Card Connection Mode: 拔插式; Connector Type: 卡座; Symbol: TF-123-ARP9H17; Device: TF-123-ARP9H17; LCSC Part Name: 拔插式 MicroSD卡(TF卡) 卡座; SupplierPart: C2982548; ManufacturerPart: TF-123-ARP9H17; Supplier Footprint: SMD; JLCPCB Part Class: Extended Part; Datasheet: https://item.szlcsc.com/datasheet/TF-123-ARP9H17/3412810.html; Supplier: LCSC; ConvertToPcb: yes; FootprintName: TF-SMD_TF-123-ARP9H15; ModelName: TF-SMD_TF-123-ARP9H15; Card Type: MicroSD卡(TF卡); Additional Card Detection Pins: -; Supplementary Features: -; Height Above Board: 1.7mm; Operating Temperature: -25℃~+85℃
USB1 = MC-107DMS: 连接器类型:Type-C;协议标准:USB 3.1;公母:母;安装方式:卧贴;触点数量:16P;端口数量:1;额定电流 - 电源:5A;工作温度:-40℃~+85℃;; Manufacturer: HANBO(汉博); AddInBom: yes; ModelId: fe707b95a1a44c64adb0608f19c92e7d0819f05c4eef4c71ace90d822a990e87; ModelTransform: 351.9678,301.1805,0,0,0,0,0,-47.244,-43.307; Connector Type: Type-C; Protocol Standard: USB 3.1; Gender: 母; Number of Contacts: 16P; Number of Ports: 1; Current Rating-Power: 5A; Connect-Disconnect Life: 1万次; Symbol: MC-107DMS; Device: MC-107DMS; LCSC Part Name: Type-C 母 卧贴; SupplierPart: C3039295; ManufacturerPart: MC-107DMS; Supplier Footprint: SMD; JLCPCB Part Class: Extended Part; Datasheet: https://item.szlcsc.com/datasheet/MC-107DMS/3592971.html; Supplier: LCSC; ConvertToPcb: yes; FootprintName: USB-C-SMD_MC-107DMS; ModelName: USB-C-SMD_MC-107DMS; Mounting Type: 卧贴; Length: 7.35mm; Operating Temperature: -40℃~+85℃
USB2 = MC-107DMS: 连接器类型:Type-C;协议标准:USB 3.1;公母:母;安装方式:卧贴;触点数量:16P;端口数量:1;额定电流 - 电源:5A;工作温度:-40℃~+85℃;; Manufacturer: HANBO(汉博); 3D Model: fe707b95a1a44c64adb0608f19c92e7d0819f05c4eef4c71ace90d822a990e87; 3D Model Transform: 351.9678,301.1805,0,0,0,0,0,-47.244,-43.307; Connector Type: Type-C; Protocol Standard: USB 3.1; Gender: 母; Number of Contacts: 16P; Number of Ports: 1; Current Rating-Power: 5A; Connect-Disconnect Life: 1万次; AddInBom: yes; Symbol: MC-107DMS; Device: MC-107DMS; LCSC Part Name: Type-C 母 卧贴; Supplier Part: C3039295; Manufacturer Part: MC-107DMS; Supplier Footprint: SMD; JLCPCB Part Class: Extended Part; Datasheet: https://item.szlcsc.com/datasheet/MC-107DMS/3592971.html; Supplier: LCSC; Mounting Type: 卧贴; Length: 7.35mm; Operating Temperature: -40℃~+85℃; ConvertToPcb: yes; FootprintName: USB-C-SMD_MC-107DMS; ModelName: USB-C-SMD_MC-107DMS
X1 = X252024MRB4SI: 晶振类型:贴片晶振;频率:24MHz;常温频差:±10ppm;负载电容:18pF;频率稳定度:±20ppm;; Manufacturer: YXC(扬兴晶振); AddInBom: yes; ModelId: d23e0abc26e54c15b6292fd5f43702fa0819f05c4eef4c71ace90d822a990e87; ModelTransform: 98.425,78.74,0,0,0,0,0,0,0; Normal temperature Frequency Tolerance: ±10ppm; Load Capacitance: 18pF; Frequency Stability: ±20ppm; Symbol: X252024MRB4SI; Device: X252024MRB4SI; LCSC Part Name: YSX221SL 24MHZ 4P 2520 18PF ±10PPM -40~85℃ (±20PPM）; SupplierPart: C371128; ManufacturerPart: X252024MRB4SI; Supplier Footprint: SMD2520-4P; JLCPCB Part Class: Extended Part; Datasheet: https://item.szlcsc.com/datasheet/X252024MRB4SI/344725.html; Supplier: LCSC; ConvertToPcb: yes; FootprintName: CRYSTAL-SMD_4P-L2.5-W2.0-BL; ModelName: CRYSTAL-SMD_4P-L2.5-W2.0-BL; Type: 贴片晶振; Value: 24MHz; Operating Temperature: -40℃~+85℃